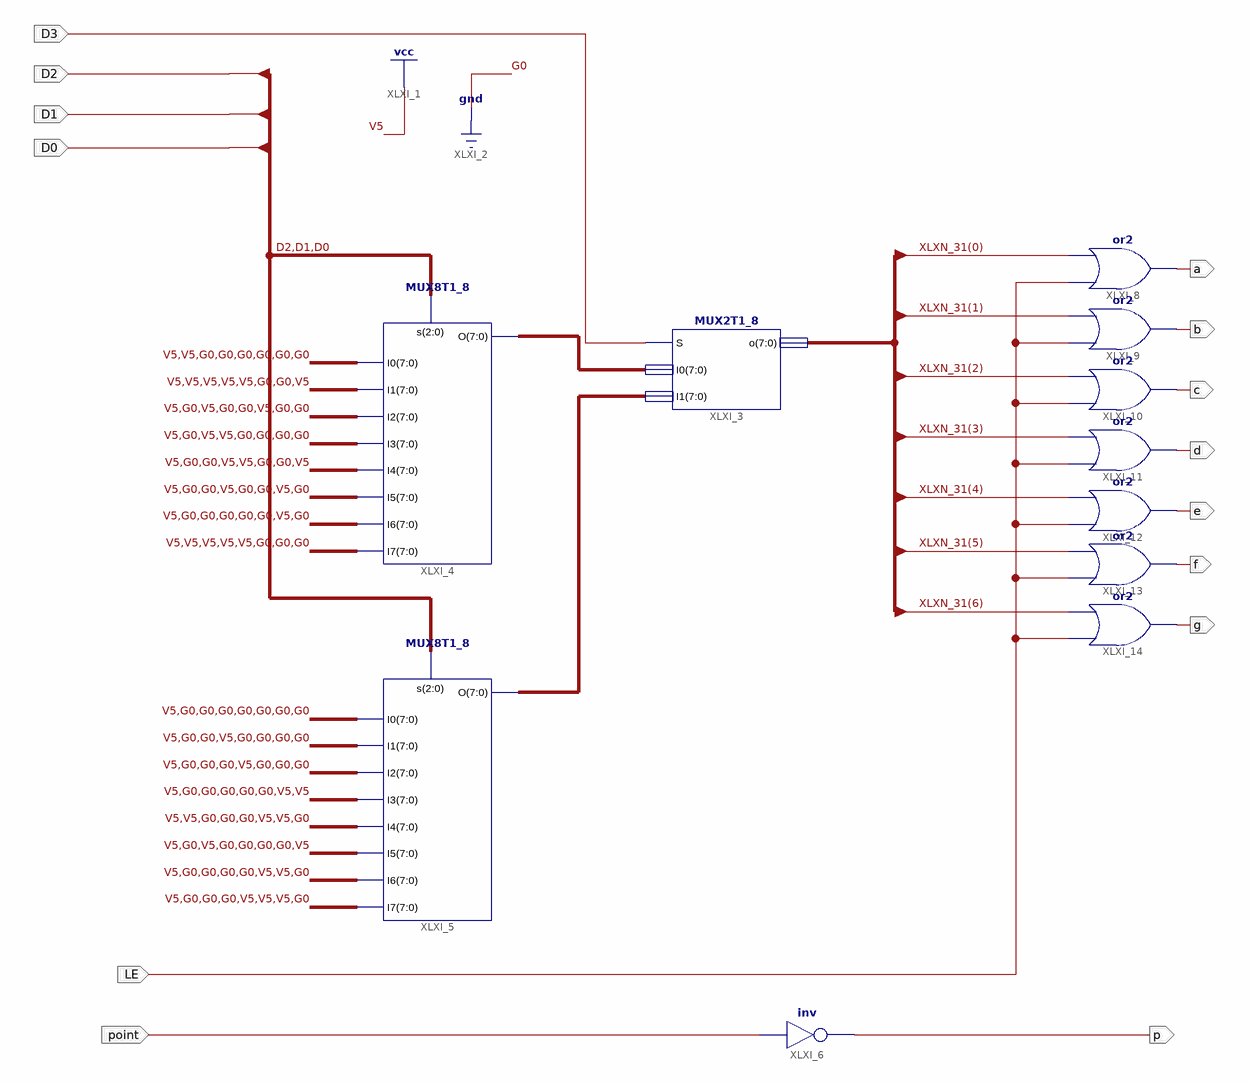
[diagram p0: schematic sheet 1]
// Xilinx ISE schematic MC14495_ZJU.sch (kintex7) as structural Verilog: 11 symbols, 14 ports
module MC14495_ZJU (
  input  D3,
  input  D2,
  input  D1,
  input  D0,
  input  LE,
  input  point,
  output p,
  output a,
  output b,
  output c,
  output d,
  output e,
  output f,
  output g
);

  wire [7:0] XLXN_12, XLXN_13, XLXN_31;

  MUX2T1_8 XLXI_3 (.S(D3), .I0(XLXN_12), .I1(XLXN_13), .o(XLXN_31));
  MUX8T1_8 XLXI_4 (
    .I0(8'b11000000), .I1(8'b11111001), .I2(8'b10100100), .I3(8'b10110000), .I4(8'b10011001),
    .I5(8'b10010010), .I6(8'b10000010), .I7(8'b11111000), .O(XLXN_12), .s({D2, D1, D0}));
  MUX8T1_8 XLXI_5 (
    .I0(8'b10000000), .I1(8'b10010000), .I2(8'b10001000), .I3(8'b10000011), .I4(8'b11000110),
    .I5(8'b10100001), .I6(8'b10000110), .I7(8'b10001110), .O(XLXN_13), .s({D2, D1, D0}));
  not XLXI_6 (p, point);
  or XLXI_8 (a, LE, XLXN_31[0]);
  or XLXI_9 (b, LE, XLXN_31[1]);
  or XLXI_10 (c, LE, XLXN_31[2]);
  or XLXI_11 (d, LE, XLXN_31[3]);
  or XLXI_12 (e, LE, XLXN_31[4]);
  or XLXI_13 (f, LE, XLXN_31[5]);
  or XLXI_14 (g, LE, XLXN_31[6]);
endmodule
